# Altium schematic sheet 03.SchDoc
size 297 x 209 mm
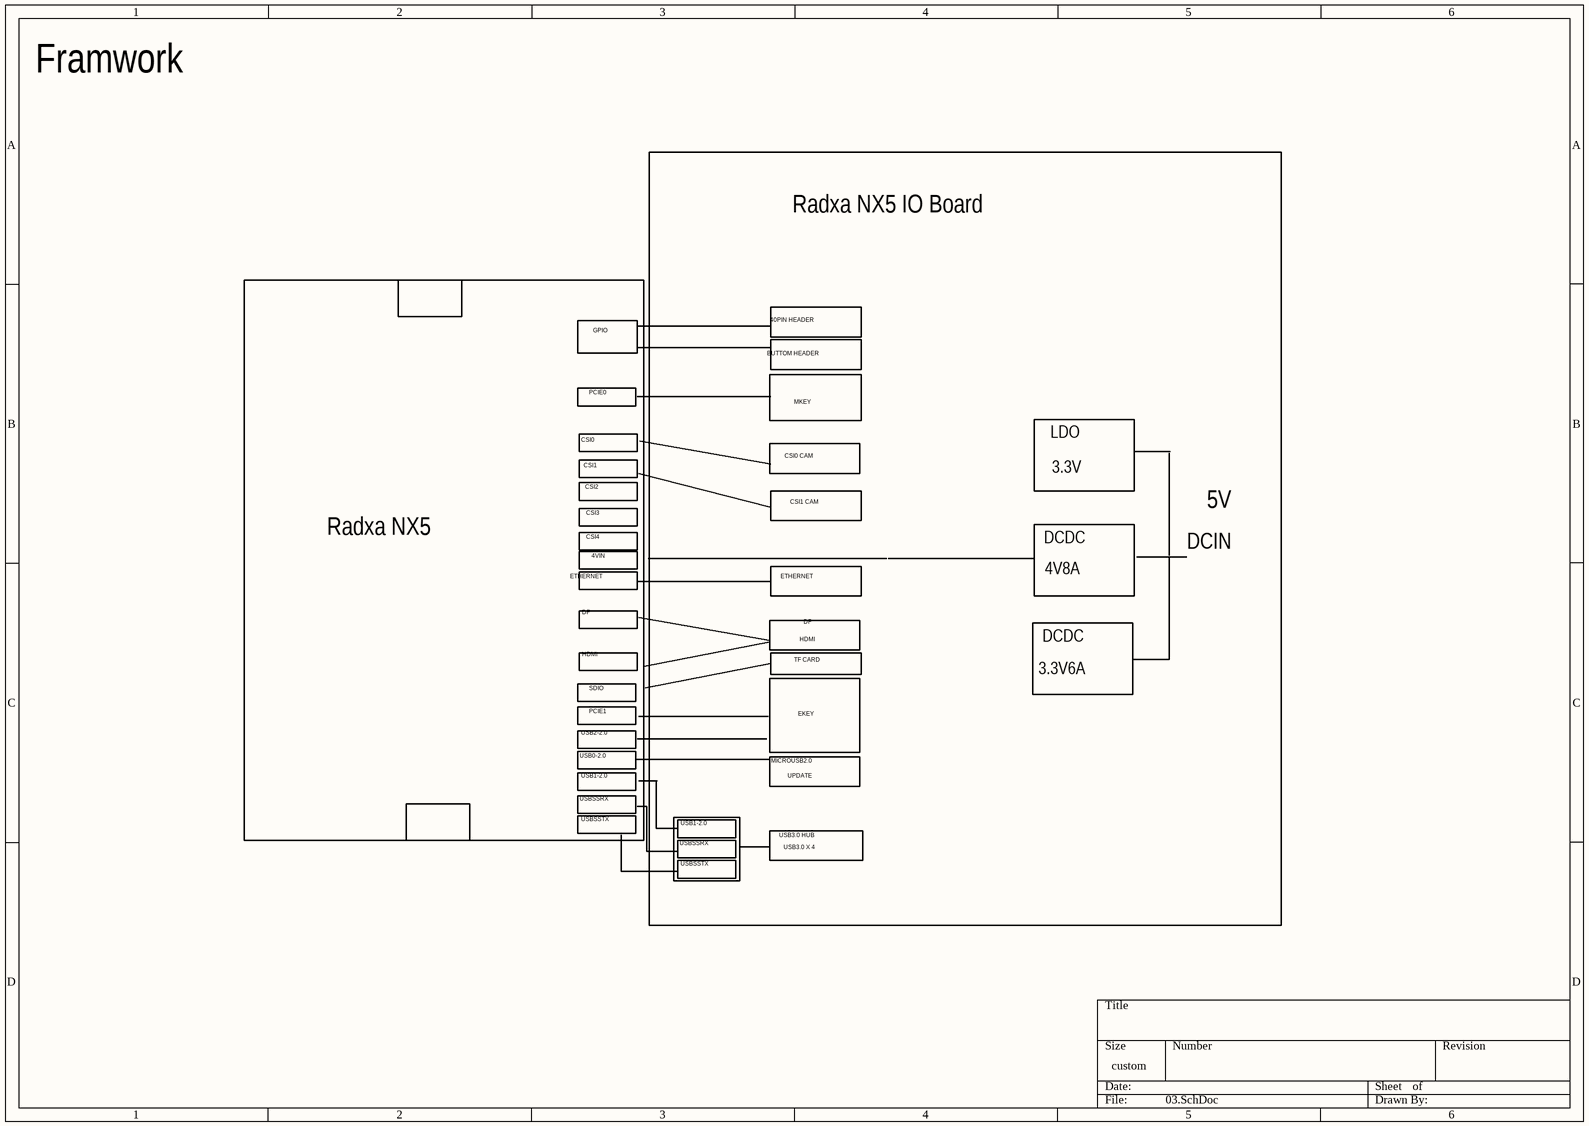
[diagram p0: 03.SchDoc]

## Notes on the sheet
- Framwork
- Radxa NX5 IO Board
- GPIO
- 40PIN HEADER
- PCIE0
- BUTTOM HEADER
- MKEY
- CSI0
- CSI1
- CSI0 CAM
- LDO
- 3.3V
- Radxa NX5
- CSI2
- CSI3
- CSI4
- CSI1 CAM
- 5V
- ETHERNET
- 4VIN
- DCDC
- 4V8A
- DCIN
- HDMI
- DP
- TF CARD
- 3.3V6A
- USB2-2.0
- PCIE1
- SDIO
- EKEY
- USB0-2.0
- USBSSRX
- USB1-2.0
- MICROUSB2.0
- UPDATE
- USBSSTX
- USB3.0 HUB
- USB3.0 X 4